# EAGLE design avr_mainboard_v004 (EAGLE 5.07)
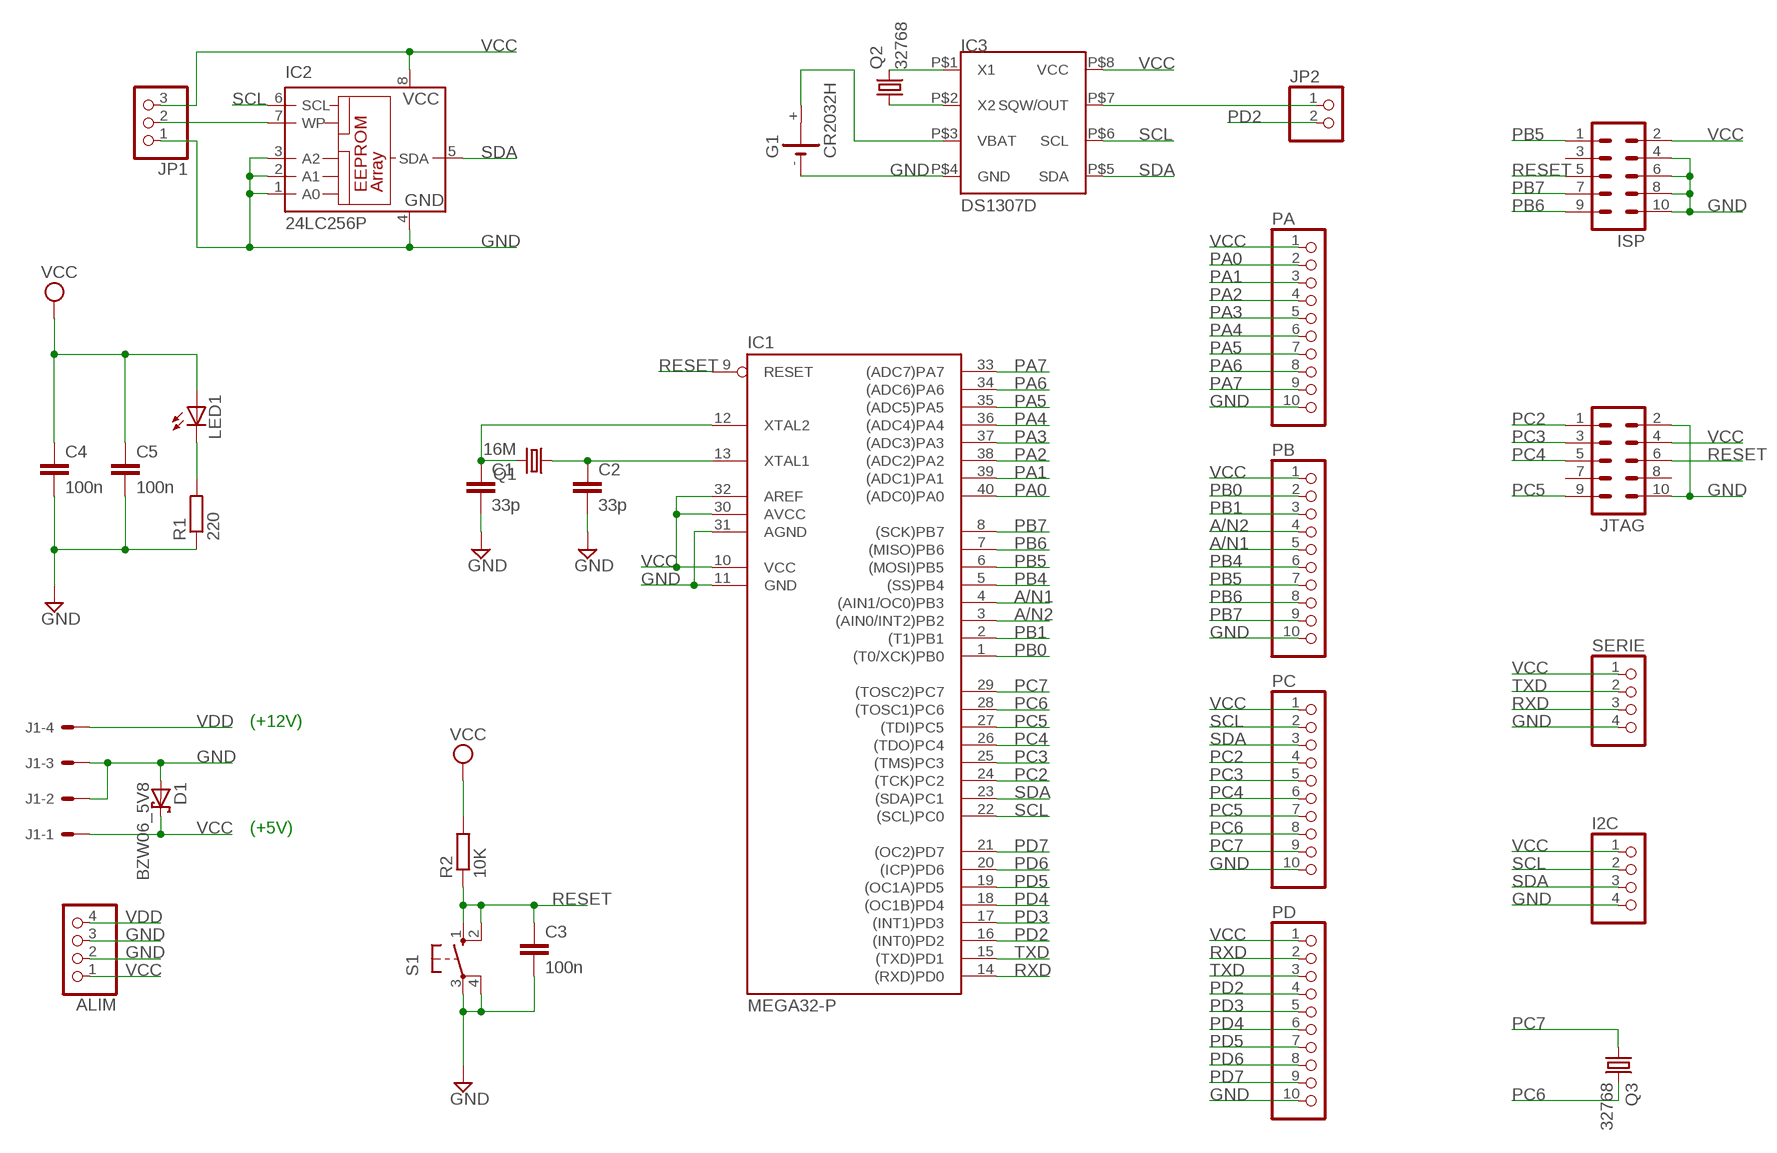
[diagram p0: schematic, sheet 1]

## Parts
ALIM  PINHD-1X4  [1X04]
C1  33p  C-EU050-024X044  [C050-024X044]
C2  33p  C-EU050-024X044  [C050-024X044]
C3  100n  C-EU050-025X075  [C050-025X075]
C4  100n  C-EU050-025X075  [C050-025X075]
C5  100n  C-EU050-025X075  [C050-025X075]
D1  BZW06_5V8  BZW04XX  [F126Z12]
G1  CR2032H  [CR2032H]
I2C  PINHD-1X4  [1X04]
IC1  MEGA32-P  [DIL40]
IC2  24LC256P  [DIL8]
IC3  DS1307D  [DIL08]
ISP  ML10L  [ML10L]
J1  22-05-7048-04  [7395-04]
JP1  PINHD-1X3  [1X03]
JP2  PINHD-1X2  [1X02]
JTAG  ML10L  [ML10L]
LED1  LED3MM  [LED3MM]
PA  PINHD-1X10  [1X10]
PB  PINHD-1X10  [1X10]
PC  PINHD-1X10  [1X10]
PD  PINHD-1X10  [1X10]
Q1  16M  CRYTALHC49U-LM  [HC49U-LM]
Q2  32768  CRYTALTC26H  [TC26H]
Q3  32768  CRYTALTC26H  [TC26H]
R1  220  R-EU_0207/10  [0207/10]
R2  10K  R-EU_0207/10  [0207/10]
S1  10-XX  [B3F-10XX]
SERIE  PINHD-1X4  [1X04]

## Nets
A/N1: IC1.4((AIN1/OC0)PB3) PB.5
A/N2: IC1.3((AIN0/INT2)PB2) PB.4
GND: ALIM.2 ALIM.3 C1.2 C2.2 C3.2 C4.2 C5.2 D1.A G1.- I2C.4 IC1.11(GND) IC1.31(AGND) IC2.1(A0) IC2.2(A1) IC2.3(A2) IC2.4(GND) IC3.P$4(GND) ISP.4 ISP.6 ISP.8 ISP.10 J1.2 J1.3 JP1.1 JTAG.2 JTAG.10 PA.10 PB.10 PC.10 PD.10 R1.1 S1.3(P) S1.4(P1) SERIE.4
N$1: LED1.K(C) R1.2
N$2: IC2.7(WP) JP1.2
N$4: G1.+ IC3.P$3(VBAT)
N$6: IC3.P$2(X2) Q2.1
N$7: IC3.P$1(X1) Q2.2
N$8: C1.1 IC1.12(XTAL2) Q1.2
N$9: C2.1 IC1.13(XTAL1) Q1.1
N$10: IC3.P$7(SQW/OUT) JP2.1
PA0: IC1.40((ADC0)PA0) PA.2
PA1: IC1.39((ADC1)PA1) PA.3
PA2: IC1.38((ADC2)PA2) PA.4
PA3: IC1.37((ADC3)PA3) PA.5
PA4: IC1.36((ADC4)PA4) PA.6
PA5: IC1.35((ADC5)PA5) PA.7
PA6: IC1.34((ADC6)PA6) PA.8
PA7: IC1.33((ADC7)PA7) PA.9
PB0: IC1.1((T0/XCK)PB0) PB.2
PB1: IC1.2((T1)PB1) PB.3
PB4: IC1.5((SS)PB4) PB.6
PB5: IC1.6((MOSI)PB5) ISP.1 PB.7
PB6: IC1.7((MISO)PB6) ISP.9 PB.8
PB7: IC1.8((SCK)PB7) ISP.7 PB.9
PC2: IC1.24((TCK)PC2) JTAG.1 PC.4
PC3: IC1.25((TMS)PC3) JTAG.3 PC.5
PC4: IC1.26((TDO)PC4) JTAG.5 PC.6
PC5: IC1.27((TDI)PC5) JTAG.9 PC.7
PC6: IC1.28((TOSC1)PC6) PC.8 Q3.2
PC7: IC1.29((TOSC2)PC7) PC.9 Q3.1
PD2: IC1.16((INT0)PD2) JP2.2 PD.4
PD3: IC1.17((INT1)PD3) PD.5
PD4: IC1.18((OC1B)PD4) PD.6
PD5: IC1.19((OC1A)PD5) PD.7
PD6: IC1.20((ICP)PD6) PD.8
PD7: IC1.21((OC2)PD7) PD.9
RESET: C3.1 IC1.9(RESET) ISP.5 JTAG.6 R2.1 S1.1(S) S1.2(S1)
RXD: IC1.14((RXD)PD0) PD.2 SERIE.3
SCL: I2C.2 IC1.22((SCL)PC0) IC2.6(SCL) IC3.P$6(SCL) PC.2
SDA: I2C.3 IC1.23((SDA)PC1) IC2.5(SDA) IC3.P$5(SDA) PC.3
TXD: IC1.15((TXD)PD1) PD.3 SERIE.2
VCC: ALIM.1 C4.1 C5.1 D1.C I2C.1 IC1.10(VCC) IC1.30(AVCC) IC1.32(AREF) IC2.8(VCC) IC3.P$8(VCC) ISP.2 J1.1 JP1.3 JTAG.4 LED1.A PA.1 PB.1 PC.1 PD.1 R2.2 SERIE.1
VDD: ALIM.4 J1.4
Unconnected: G1.+@1(+) ISP.3 JTAG.7 JTAG.8

## Notes on the sheet
- (+12V)
- (+5V)

## Library data of the parts
ALIM I2C SERIE = pinhead:PINHD-1X4: PIN HEADER
C1-C5 = rcl:C-EU: CAPACITOR, European symbol
D1 = diode:BZW04XX: DIODE
G1 = battery:CR2032H: LI BATTERY Varta
IC1 = atmel:MEGA32-P: MICROCONTROLLER 32 Kbytes FLASH 2 Kbytes SRAM 1 Kbytes EEPROM USART 8-channel 10 bit ADC Source: www.atmel.com .. doc2503.pdf
IC2 = microchip:24*: Serial EEPROM I2C
IC3 = dallas-1:DS1307D
ISP JTAG = con-harting-ml:ML10: HARTING
J1 = con-molex:22-?-04: CONNECTOR wire to board 2.54 mm (.1 inch) pitch header
JP1 = pinhead:PINHD-1X3: PIN HEADER
JP2 = pinhead:PINHD-1X2: PIN HEADER
LED1 = led:LED: LED OSRAM: - CHIPLED LG R971, LG N971, LY N971, LG Q971, LY Q971, LO R971, LY R971 LH N974, LH R974 LS Q976, LO Q976, LY Q976 LO Q996 - Hyper CHIPLED LW Q18S LB Q993, LB Q99A, LB R99A - SideLED LS A670, LO A670, LY A670, LG A670, LP A670 LB A673, LV A673, LT A673, LW A673 LH A674 LY A675 LS A676, LA A676, LO A676, LY A676, LW A676 LS A679, LY A679, LG A679 - Hyper Micro SIDELED® LS Y876, LA Y876, LO Y876, LY Y876 LT Y87S - SmartLED LW L88C, LW L88S LB L89C, LB L89S, LG L890 LS L89K, LO L89K, LY L89K LS L896, LA L896, LO L896, LY L896 - TOPLED LS T670, LO T670, LY T670, LG T670, LP T670 LSG T670, LSP T670, LSY T670, LOP T670, LYG T670 LG T671, LOG T671, LSG T671 LB T673, LV T673, LT T673, LW T673 LH T674 LS T676, LA T676, LO T676, LY T676, LB T676, LH T676, LSB T676, LW T676 LB T67C, LV T67C, LT T67C, LS T67K, LO T67K, LY T67K, LW E67C LS E67B, LA E67B, LO E67B, LY E67B, LB E67C, LV E67C, LT E67C LW T67C LS T679, LY T679, LG T679 LS T770, LO T770, LY T770, LG T770, LP T770 LB T773, LV T773, LT T773, LW T773 LH T774 LS E675, LA E675, LY E675, LS T675 LS T776, LA T776, LO T776, LY T776, LB T776 LHGB T686 LT T68C, LB T68C - Hyper Mini TOPLED® LB M676 - Mini TOPLED Santana® LG M470 LS M47K, LO M47K, LY M47K Source: http://www.osram.convergy.de/
PA PB PC PD = pinhead:PINHD-1X10: PIN HEADER
Q1-Q3 = crystal:CRYTAL: CRYSTAL
R1 R2 = rcl:R-EU_: RESISTOR, European symbol
S1 = switch-omron:10-XX: OMRON SWITCH

## Board
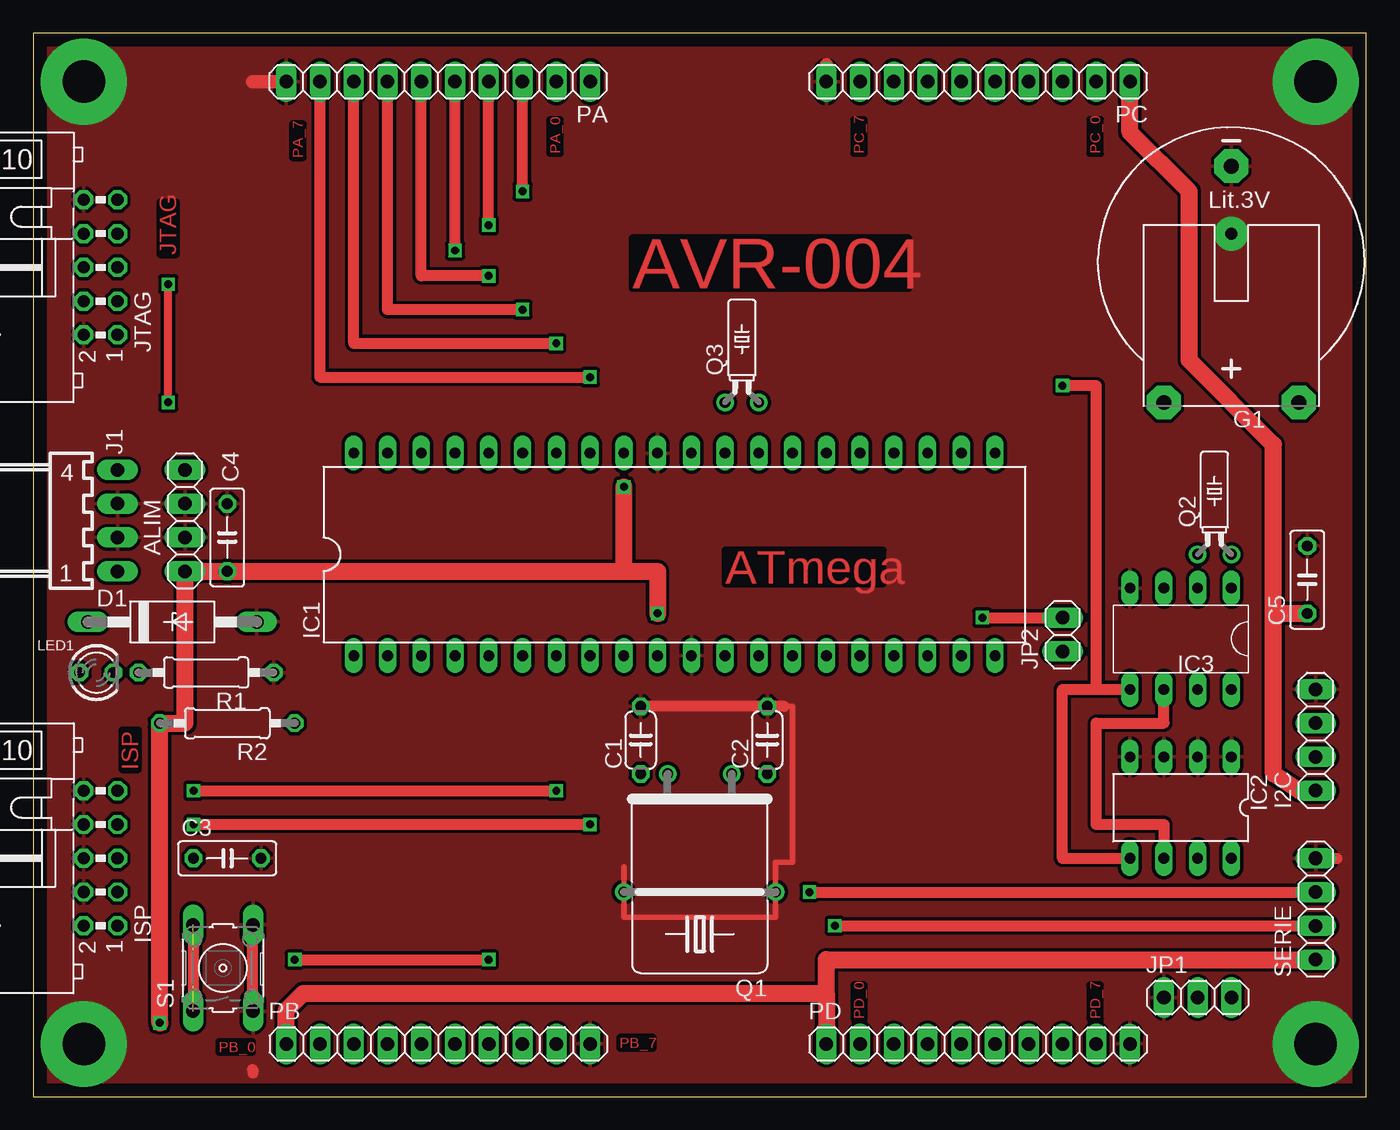
[diagram p1: board, top side]
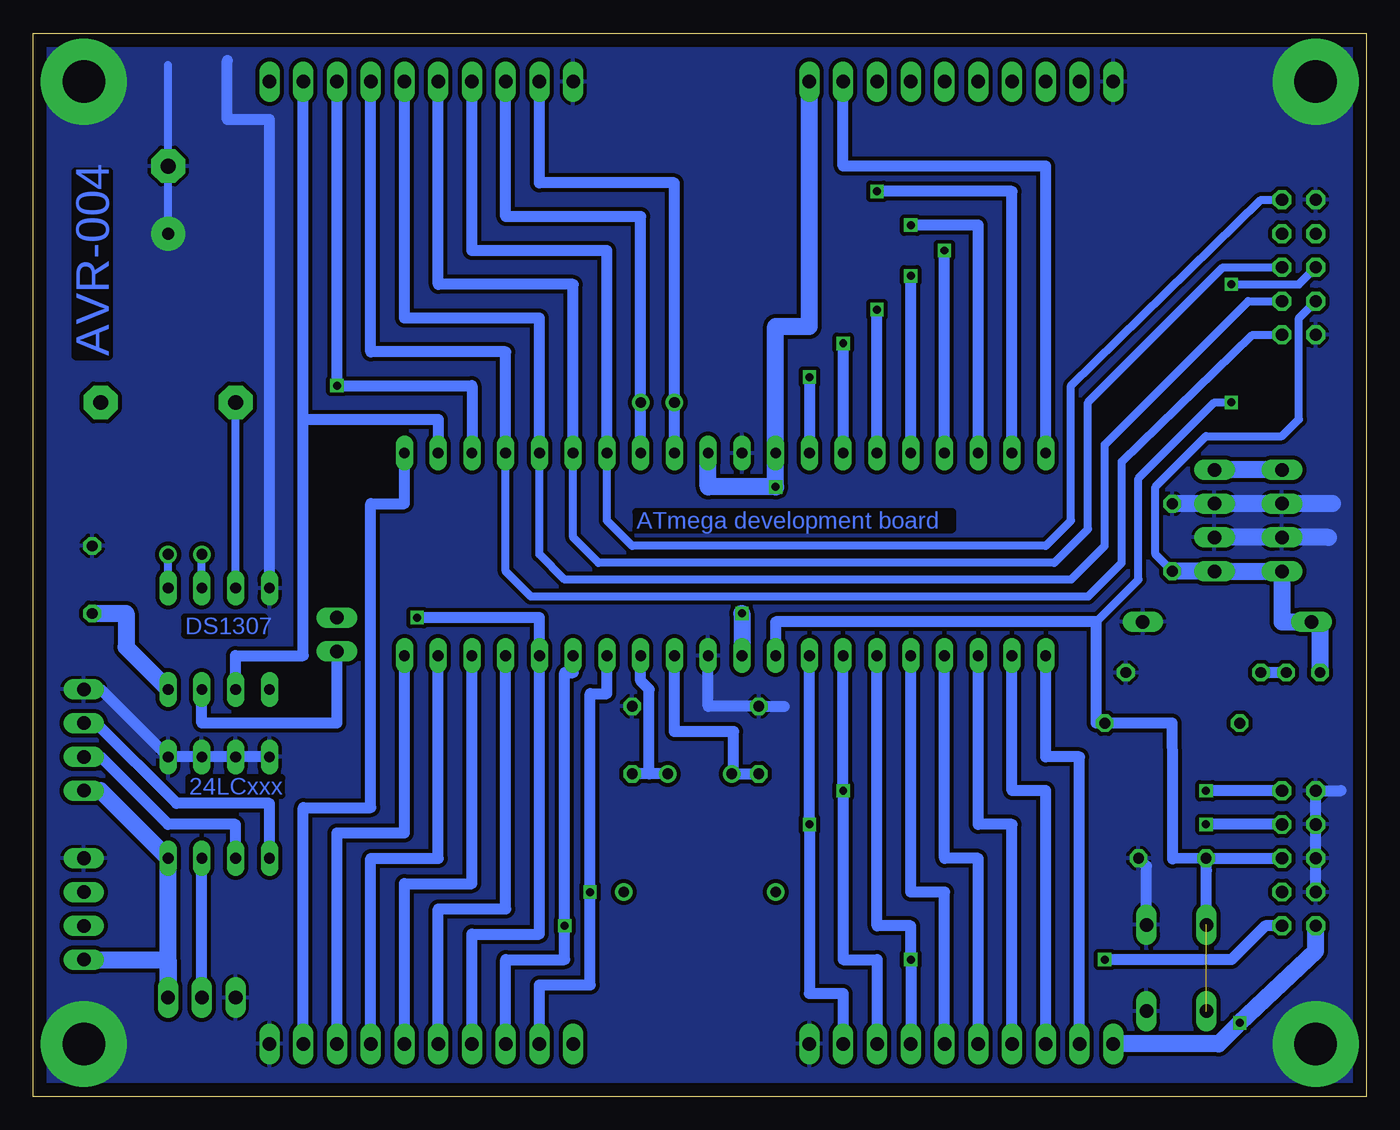
[diagram p2: board, bottom side, seen from below]

Size 100.32 x 80 mm. Coordinates in mm from the lower left corner, seen from the top.
Outline: 100.32,0 100.32,80 0,80 0,0 100.32,0
Copper layers (1*16): Top 0.035mm / dielectric 1.5mm / Bottom 0.035mm
Design rules "default": minimum track width 10mil, minimum drill 24mil, track to track 8mil, track to pad 8mil, pad to pad 8mil, via to via 8mil, smd to smd 8mil, copper to edge 40mil, drill to drill 8mil, minimum pad ring 10mil, minimum via ring 8mil, stop-mask expansion 4mil, vias tented up to drill 0mil, thermal gap 10mil

### Footprints (pad centres in the part's own frame; a part is rotated, then mirrored left to right if it is on the bottom)
1X04 = drill 1.016 long: 1 -3.81,0; 2 -1.27,0; 3 1.27,0; 4 3.81,0
C050-024X044 = drill 0.813 octagon: 1 -2.54,0; 2 2.54,0
C050-025X075 = drill 0.813 octagon: 1 -2.54,0; 2 2.54,0
F126Z12 = drill 1.016 long: A 6.35,0; C -6.35,0
CR2032H = drill 1.118 pad 2.54 octagon: + 5.08,10.795; +@1 -5.08,10.795; - 0,-6.985
DIL40 = drill 0.813 long: 1 -24.13,-7.62; 2 -21.59,-7.62; 3 -19.05,-7.62; 4 -16.51,-7.62; 5 -13.97,-7.62; 6 -11.43,-7.62; 7 -8.89,-7.62; 8 -6.35,-7.62; 9 -3.81,-7.62; 10 -1.27,-7.62; 11 1.27,-7.62; 12 3.81,-7.62; 13 6.35,-7.62; 14 8.89,-7.62; 15 11.43,-7.62; 16 13.97,-7.62; 17 16.51,-7.62; 18 19.05,-7.62; 19 21.59,-7.62; 20 24.13,-7.62; 21 24.13,7.62; 22 21.59,7.62; 23 19.05,7.62; 24 16.51,7.62; 25 13.97,7.62; 26 11.43,7.62; 27 8.89,7.62; 28 6.35,7.62; 29 3.81,7.62; 30 1.27,7.62; 31 -1.27,7.62; 32 -3.81,7.62; 33 -6.35,7.62; 34 -8.89,7.62; 35 -11.43,7.62; 36 -13.97,7.62; 37 -16.51,7.62; 38 -19.05,7.62; 39 -21.59,7.62; 40 -24.13,7.62
DIL8 = drill 0.813 long: 1 -3.81,-3.81; 2 -1.27,-3.81; 3 1.27,-3.81; 4 3.81,-3.81; 5 3.81,3.81; 6 1.27,3.81; 7 -1.27,3.81; 8 -3.81,3.81
DIL08 = drill 0.8 long: P$1 -3.81,-3.81; P$2 -1.27,-3.81; P$3 1.27,-3.81; P$4 3.81,-3.81; P$5 3.81,3.81; P$6 1.27,3.81; P$7 -1.27,3.81; P$8 -3.81,3.81
ML10L = drill 0.914 octagon: 1 -5.08,-1.27; 2 -5.08,1.27; 3 -2.54,-1.27; 4 -2.54,1.27; 5 0,-1.27; 6 0,1.27; 7 2.54,-1.27; 8 2.54,1.27; 9 5.08,-1.27; 10 5.08,1.27
7395-04 = drill 1.016 long: 1 3.81,0; 2 1.27,0; 3 -1.27,0; 4 -3.81,0
1X03 = drill 1.016 long: 1 -2.54,0; 2 0,0; 3 2.54,0
1X02 = drill 1.016 long: 1 -1.27,0; 2 1.27,0
LED3MM = drill 0.813 octagon: A -1.27,0; K 1.27,0
1X10 = drill 1.016 long: 1 -11.43,0; 2 -8.89,0; 3 -6.35,0; 4 -3.81,0; 5 -1.27,0; 6 1.27,0; 7 3.81,0; 8 6.35,0; 9 8.89,0; 10 11.43,0
HC49U-LM = drill 0.813 round: 1 -2.413,-5.08; 2 2.413,-5.08; M -5.715,3.81; M1 5.715,3.81
TC26H = drill 0.813 round: 1 -1.27,0; 2 1.27,0
0207/10 = drill 0.813 octagon: 1 -5.08,0; 2 5.08,0
B3F-10XX = drill 1.016 long: 1 -3.251,2.261; 2 3.251,2.261; 3 -3.251,-2.261; 4 3.251,-2.261

### Placement (x,y rotation side)
ALIM  11.42,43.33 90 top
C1  45.71,26.82 90 top
C2  55.24,26.82 90 top
C3  14.6,17.93 0 top
C4  14.6,42.06 90 top
C5  95.88,38.89 90 top
D1  10.47,35.71 0 top
G1  90.17,63.02 180 top
I2C  96.52,26.82 90 top
IC1  48.25,40.79 0 top
IC2  86.36,21.74 180 top
IC3  86.36,34.44 180 top
ISP  5.08,17.93 90 top
J1  6.34,43.33 270 top
JP1  87.62,7.46 0 top
JP2  77.47,34.76 90 top
JTAG  5.08,62.38 90 top
LED1  4.76,31.9 0 top
PA  30.48,76.35 180 top
PB  30.48,3.96 0 top
PC  71.12,76.35 180 top
PD  71.12,3.96 0 top
Q1  50.16,19.2 180 top
Q2  88.9,40.79 0 top
Q3  53.34,52.22 0 top
R1  13.01,31.9 180 top
R2  14.6,28.09 180 top
S1  14.28,9.68 90 top
SERIE  96.52,14.12 90 top

### Tracks (layer width: path | path; a pad name or v marks a point on that pad's centre or on a via)
A/N1
  Bottom 0.813: PB.5 29.21,17.93 31.75,17.93 IC1.4
A/N2
  Bottom 0.813: PB.4 26.67,20.47 29.21,20.47 IC1.3
GND  (via drill 0.9 pad 2.54, 3.2 pad 6.45)
  Top 0.406: 56.51,29.36 57.14,29.36 57.14,17.61 55.88,17.61 55.88,13.49 44.45,13.49 44.45,17.3
  Top 0.813: SERIE.4 98.1,17.93 | C1.2 C2.2 56.51,29.36 | 16.51,2.06 16.54,1.78
  Top 1.016: PC.10 59.68,77.62 | 16.51,76.35 PA.10
  Bottom 0.61: 90.17,77.62 G1.- v90.17,64.92
  Bottom 0.813: ALIM.2 J1.2 | ISP.4 ISP.6 ISP.8 ISP.10 1.9,23.01 | IC3.P$4 82.55,73.5 85.72,73.5 85.72,77.94 | IC2.4 IC2.3 IC2.2 IC2.1 95.25,30.63 I2C.4 | 43.81,29.36 C1.2 49.52,29.36 IC1.11 | S1.4 16.54,17.34 C3.2
  Bottom 1.27: C4.2 ALIM.3 J1.3 2.54,44.6 | 2.85,42.06 ALIM.2
  other vias: 3.81,3.96 96.52,3.96 96.52,76.35 3.81,76.35
  pour Top (isolate 0.254): 0.31,0.15 0.31,79.84 100.01,79.84 100.01,0.15
  pour Bottom (isolate 0.305, rank 3): 0.63,0.47 0.63,79.84 100.01,79.84 100.01,0.47
N$1
  Bottom 0.813: LED1.K R1.2
N$2
  Bottom 0.813: JP1.2 IC2.7
N$3
  Top 0.813: 12.06,6.5 12.06,12.85
N$4
  Bottom 0.61: IC3.P$3 G1.+
N$5
  Top 0.813: 16.51,6.5 16.51,12.85
N$6
  Bottom 0.61: IC3.P$2 Q2.1
N$7
  Bottom 0.61: IC3.P$1 Q2.2
N$8
  Bottom 0.813: Q1.2 47.62,24.28 | 47.62,24.28 C1.1 | 47.62,24.28 47.62,27.46 52.06,27.46 IC1.12
N$9
  Bottom 0.813: 53.97,24.28 C2.1 | Q1.1 53.97,24.28 | 53.97,24.28 53.97,30.63 54.6,31.27 IC1.13
N$10
  Bottom 0.813: IC3.P$7 87.62,28.09 77.47,28.09 JP2.1
PA0
  Bottom 0.813: PA.2 39.36,70 24.12,70 IC1.40
PA1  (via drill 0.6)
  Top 0.813: v36.82,68.1 PA.3
  Bottom 0.813: v36.82,68.1 26.67,68.1 IC1.39
PA2  (via drill 0.6)
  Top 0.813: v34.28,65.56 PA.4
  Bottom 0.813: v34.28,65.56 29.21,65.56 IC1.38
PA3  (via drill 0.6)
  Top 0.813: v31.75,63.65 PA.5
  Bottom 0.813: IC1.37 v31.75,63.65
PA4  (via drill 0.6)
  Top 0.813: v34.28,61.75 29.21,61.75 PA.6
  Bottom 0.813: IC1.36 v34.28,61.75
PA5  (via drill 0.6)
  Top 0.813: v36.82,59.21 26.67,59.21 PA.7
  Bottom 0.813: IC1.35 v36.82,59.21
PA6  (via drill 0.6)
  Top 0.813: v39.36,56.67 24.12,56.67 PA.8
  Bottom 0.813: v39.36,56.67 IC1.34
PA7  (via drill 0.6)
  Top 0.813: v41.9,54.13 21.59,54.13 PA.9
  Bottom 0.813: v41.9,54.13 IC1.33
PB0
  Bottom 0.813: PB.2 21.59,25.55 24.12,25.55 IC1.1
PB1
  Bottom 0.813: PB.3 24.12,23.01 26.67,23.01 IC1.2
PB4
  Bottom 0.813: PB.6 31.75,15.39 34.28,15.39 IC1.5
PB5  (via drill 0.6)
  Top 0.813: v19.68,10.31 v34.28,10.31
  Bottom 0.813: PB.7 v34.28,10.31 34.28,12.85 36.82,12.85 IC1.6 | ISP.1 7.62,12.85 10.15,10.31 v19.68,10.31
PB6  (via drill 0.6)
  Top 0.813: v12.06,23.01 v39.36,23.01
  Bottom 0.813: PB.8 36.82,10.31 39.36,10.31 v39.36,23.01 IC1.7 | ISP.9 v12.06,23.01
PB7  (via drill 0.6)
  Top 0.813: v12.06,20.47 v41.9,20.47
  Bottom 0.813: PB.9 39.36,7.77 41.9,7.77 v41.9,20.47 IC1.8 | ISP.7 v12.06,20.47
PC2
  Bottom 0.61: JTAG.1 8.57,57.3 18.41,47.78 18.41,40.16 20.95,37.62 62.86,37.62 64.77,39.52 IC1.24
  Bottom 0.813: PC.4 74.93,56.03 64.77,56.03 IC1.24
PC3
  Bottom 0.61: JTAG.3 8.88,59.84 19.68,49.05 19.68,41.43 22.22,38.89 60.32,38.89 62.22,40.79 IC1.25
  Bottom 0.813: PC.5 72.39,58.57 62.22,58.57 IC1.25
PC4
  Bottom 0.61: JTAG.5 10.79,62.38 20.95,52.22 20.95,42.7 23.49,40.16 57.78,40.16 59.68,42.06 IC1.26
  Bottom 0.813: PC.6 69.84,61.11 59.68,61.11 IC1.26
PC5
  Bottom 0.61: JTAG.9 7.93,67.46 22.22,53.49 22.22,43.33 24.12,41.43 55.24,41.43 57.14,43.33 IC1.27
  Bottom 0.813: PC.7 67.31,63.65 57.14,63.65 IC1.27
PC6
  Bottom 0.813: PC.8 64.77,66.19 54.6,66.19 Q3.2 | Q3.2 54.6,51.9 | IC1.28 Q3.2
PC7
  Bottom 0.813: PC.9 62.22,68.73 52.06,68.73 Q3.1 IC1.29
PD2  (via drill 0.6)
  Top 0.813: v71.43,36.03 JP2.2
  Bottom 0.813: PD.4 67.31,12.22 62.22,12.22 IC1.16 62.22,36.03 v71.43,36.03
PD3
  Bottom 0.813: PD.5 69.84,14.12 64.77,14.12 IC1.17
PD4
  Bottom 0.813: PD.6 72.39,16.03 67.31,16.03 IC1.18
PD5
  Bottom 0.813: PD.7 74.93,17.93 69.84,17.93 IC1.19 69.84,33.49
PD6
  Bottom 0.813: PD.8 77.47,19.84 72.7,19.84 72.39,19.84 IC1.20
PD7
  Bottom 0.813: PD.9 80.01,21.74 74.93,21.74 74.93,44.6 72.39,44.6 IC1.21
RESET  (via drill 0.6)  (1 unrouted)
  Top 0.61: v10.15,52.22 v10.15,61.11
  Bottom 0.61: JTAG.6 5.08,61.11 v10.15,61.11 | v10.15,52.22 11.42,52.22 17.14,46.51 17.14,38.89 20.32,35.71
  Bottom 0.813: IC1.9 44.45,35.71 20.32,35.71 20.32,28.09 R2.1 14.6,28.09 14.56,24.24 14.56,17.89 C3.1 | C3.1 ISP.5 | S1.2 12.02,17.02 C3.1
RXD  (via drill 0.6)
  Top 0.813: v58.41,15.39 SERIE.3
  Bottom 0.813: PD.2 62.22,8.41 58.41,8.41 v58.41,15.39 58.41,30.32 57.14,30.32 IC1.14
SCL
  Top 0.813: IC2.6 85.09,20.47 80.01,20.47 80.01,28.09 85.09,28.09 IC3.P$6
  Bottom 0.813: 80.01,50.95 PC.2 | IC3.P$6 85.09,33.17 80.01,33.17 80.01,50.95 | IC2.6 85.09,20.47 90.17,20.47 95.25,25.55 I2C.2 | 80.01,50.95 69.84,50.95 IC1.22
SDA  (via drill 0.6)
  Top 0.813: 80.01,30.63 77.47,30.63 77.47,17.93 IC2.5 | 80.01,30.63 80.01,53.49 v77.47,53.49 | 80.01,30.63 IC3.P$5
  Bottom 0.813: PC.3 v77.47,53.49 67.31,53.49 IC1.23 | IC2.5 82.55,22.06 89.53,22.06 95.56,28.09 I2C.3
TXD  (via drill 0.6)
  Top 0.813: v60.32,12.85 SERIE.2
  Bottom 0.813: PD.3 64.77,10.31 60.32,10.31 v60.32,12.85 60.32,31.9 59.68,31.9 IC1.15
VCC  (via drill 0.6)
  Top 1.27: SERIE.1 59.68,10.31 59.68,7.77 | 59.68,7.77 PD.1 | v9.52,5.55 R2.2 11.42,28.09 ALIM.1 44.45,39.52 | PC.1 82.55,72.54 86.99,68.1 86.99,55.4 93.34,49.05 93.34,36.35 | 93.34,36.35 C5.1 | 93.34,36.35 93.34,24.28 95.25,23.01 I2C.1 | 44.45,39.52 v44.45,45.87 | v46.98,36.35 46.98,39.52 44.45,39.52 | 59.68,7.77 20.32,7.77 19.05,6.5 PB.1
  Bottom 0.61: JTAG.4 5.08,58.57 5.08,50.95 6.34,49.68 12.06,49.68 15.87,45.87 15.87,40.79 C4.1
  Bottom 0.813: 95.25,23.01 I2C.1
  Bottom 1.27: PA.1 41.9,57.94 44.45,57.94 IC1.32 v44.45,45.87 49.52,45.87 IC1.30 | C4.1 ALIM.1 J1.1 6.34,35.71 D1.C 3.49,35.71 LED1.A | PB.1 11.11,3.96 v9.52,5.55 3.81,10.95 ISP.2 | C5.1 93.34,36.35 93.34,33.81 IC3.P$8 | SERIE.1 90.17,10.31 JP1.3 IC2.8 95.25,23.01 | v46.98,36.35 IC1.10
VDD
  Bottom 1.27: J1.4 ALIM.4

### Text on the board
Top: PA_0 | PC_7 | PC_0 | PA_7 | JTAG | AVR-004 | ATmega | ISP | PD_0 | PD_7 | PB_0 | PB_7
Bottom: AVR-004 | ATmega development board | DS1307 | 24LCxxx